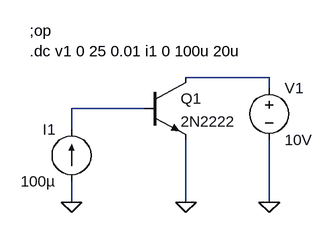
[diagram p0: schematic Exp1_P2.asc]
Exp1_P2.asc, the LTspice schematic file:
Version 4
SHEET 1 880 680
WIRE 400 176 272 176
WIRE 400 192 400 176
WIRE 208 224 96 224
WIRE 96 256 96 224
WIRE 96 368 96 336
WIRE 272 368 272 272
WIRE 400 368 400 272
FLAG 96 368 0
FLAG 272 368 0
FLAG 400 368 0
SYMBOL current 96 336 R180
WINDOW 0 24 80 Left 2
WINDOW 3 24 0 Left 2
SYMATTR InstName I1
SYMATTR Value 100µ
SYMBOL npn 208 176 R0
SYMATTR InstName Q1
SYMATTR Value 2N2222
SYMBOL voltage 400 176 R0
SYMATTR InstName V1
SYMATTR Value 10V
TEXT 32 104 Left 2 !;op\n.dc v1 0 25 0.01 i1 0 100u 20u

The netlist it stands for:
* Exp1_P2.asc
I1 0 N002 100µ
Q1 N001 N002 0 0 2N2222
V1 N001 0 10V
.model NPN NPN
.model PNP PNP
.lib standard.bjt
;op
.dc v1 0 25 0.01 i1 0 100u 20u
.backanno
.end